# EAGLE design SCHEMATIC V2 (EAGLE 8.4.0)
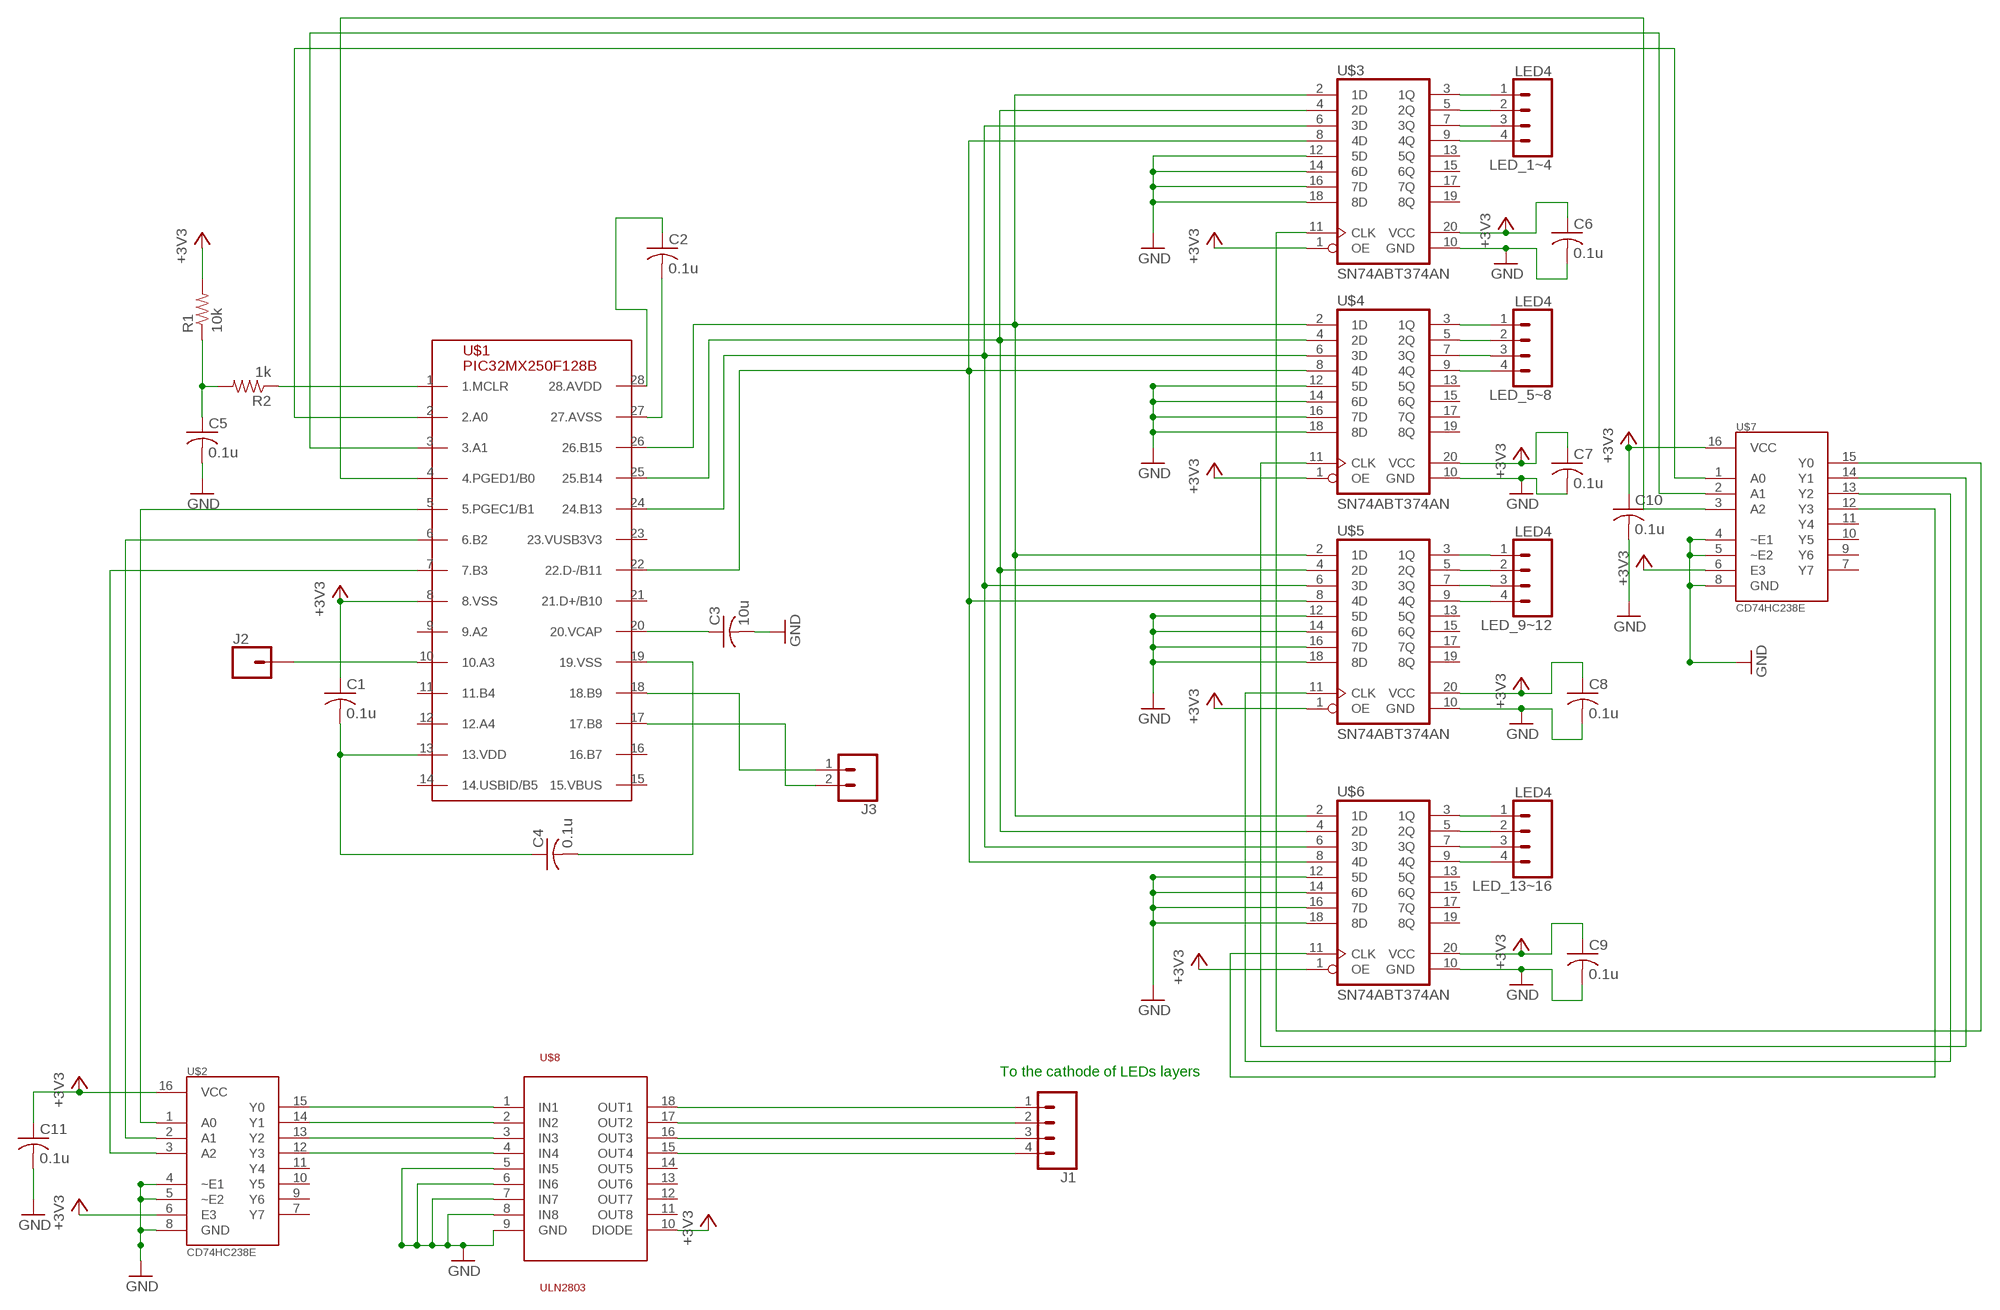
[diagram p0: schematic, sheet 1]

## Parts
C1  0.1u  C-US025-025X050  [C025-025X050]
C2  0.1u  C-US025-025X050  [C025-025X050]
C3  10u  C-US025-025X050  [C025-025X050]
C4  0.1u  C-US025-025X050  [C025-025X050]
C5  0.1u  C-US025-025X050  [C025-025X050]
C6  0.1u  C-US025-025X050  [C025-025X050]
C7  0.1u  C-US025-025X050  [C025-025X050]
C8  0.1u  C-US025-025X050  [C025-025X050]
C9  0.1u  C-US025-025X050  [C025-025X050]
C10  0.1u  C-US025-025X050  [C025-025X050]
C11  0.1u  C-US025-025X050  [C025-025X050]
J1  CONN_04  [1X04]
J2  CONN_01  [1X01]
J3  CONN_02  [1X02]
LED_1~4  LED4  [1X04]
LED_5~8  LED4  [1X04]
LED_9~12  LED4  [1X04]
LED_13~16  LED4  [1X04]
R1  10k  R-US_0204/7  [0204/7]
R2  1k  R-US_0204/7  [0204/7]
U$1  PIC32MX250F128B  [DIL28-3]
U$2  CD74HC238E  [DIL16]
U$3  SN74ABT374AN  [DIL20]
U$4  SN74ABT374AN  [DIL20]
U$5  SN74ABT374AN  [DIL20]
U$6  SN74ABT374AN  [DIL20]
U$7  CD74HC238E  [DIL16]
U$8  ULN2803  [SO18L]

## Nets
+3V3: C1.1 C6.1 C7.1 C8.1 C9.1 C10.1 C11.1 R1.2 U$1.8(8.VSS) U$2.6(E3) U$2.16(VCC) U$3.1(OE) U$3.20(VCC) U$4.1(OE) U$4.20(VCC) U$5.1(OE) U$5.20(VCC) U$6.1(OE) U$6.20(VCC) U$7.6(E3) U$7.16(VCC) U$8.10(DIODE)
GND: C3.2 C5.2 C6.2 C7.2 C8.2 C9.2 C10.2 C11.2 U$2.4(~E1) U$2.5(~E2) U$2.8(GND) U$3.10(GND) U$3.12(5D) U$3.14(6D) U$3.16(7D) U$3.18(8D) U$4.10(GND) U$4.12(5D) U$4.14(6D) U$4.16(7D) U$4.18(8D) U$5.10(GND) U$5.12(5D) U$5.14(6D) U$5.16(7D) U$5.18(8D) U$6.10(GND) U$6.12(5D) U$6.14(6D) U$6.16(7D) U$6.18(8D) U$7.4(~E1) U$7.5(~E2) U$7.8(GND) U$8.5(IN5) U$8.6(IN6) U$8.7(IN7) U$8.8(IN8) U$8.9(GND)
LED1: LED_1~4.1 U$3.3(1Q)
N$1: U$2.15(Y0) U$8.1(IN1)
N$2: U$2.14(Y1) U$8.2(IN2)
N$3: U$2.13(Y2) U$8.3(IN3)
N$4: U$2.12(Y3) U$8.4(IN4)
N$5: C1.2 C4.1 U$1.13(13.VDD)
N$6: J2.1 U$1.10(10.A3)
N$9: J1.1 U$8.18(OUT1)
N$10: J1.2 U$8.17(OUT2)
N$11: J1.3 U$8.16(OUT3)
N$12: J1.4 U$8.15(OUT4)
N$16: C3.1 U$1.20(20.VCAP)
N$17: U$1.5(5.PGEC1/B1) U$2.1(A0)
N$18: U$1.6(6.B2) U$2.2(A1)
N$19: U$1.7(7.B3) U$2.3(A2)
N$20: LED_9~12.1 U$5.3(1Q)
N$21: C4.2 U$1.19(19.VSS)
N$22: U$1.26(26.B15) U$3.2(1D) U$4.2(1D) U$5.2(1D) U$6.2(1D)
N$23: U$1.25(25.B14) U$3.4(2D) U$4.4(2D) U$5.4(2D) U$6.4(2D)
N$24: U$1.22(22.D-/B11) U$3.8(4D) U$4.8(4D) U$5.8(4D) U$6.8(4D)
N$25: U$1.24(24.B13) U$3.6(3D) U$4.6(3D) U$5.6(3D) U$6.6(3D)
N$26: C2.1 U$1.28(28.AVDD)
N$27: C2.2 U$1.27(27.AVSS)
N$28: C5.1 R1.1 R2.2
N$29: R2.1 U$1.1(1.MCLR)
N$31: U$3.11(CLK) U$7.15(Y0)
N$32: U$4.11(CLK) U$7.14(Y1)
N$33: U$1.3(3.A1) U$7.2(A1)
N$34: U$1.4(4.PGED1/B0) U$7.3(A2)
N$35: U$5.11(CLK) U$7.13(Y2)
N$36: U$6.11(CLK) U$7.12(Y3)
N$37: J3.1 U$1.18(18.B9)
N$38: LED_9~12.2 U$5.5(2Q)
N$39: U$1.2(2.A0) U$7.1(A0)
N$40: LED_1~4.2 U$3.5(2Q)
N$41: LED_1~4.3 U$3.7(3Q)
N$42: LED_1~4.4 U$3.9(4Q)
N$43: LED_9~12.3 U$5.7(3Q)
N$44: LED_9~12.4 U$5.9(4Q)
N$45: J3.2 U$1.17(17.B8)
N$47: LED_5~8.1 U$4.3(1Q)
N$48: LED_5~8.2 U$4.5(2Q)
N$49: LED_5~8.3 U$4.7(3Q)
N$50: LED_5~8.4 U$4.9(4Q)
N$63: LED_13~16.1 U$6.3(1Q)
N$64: LED_13~16.2 U$6.5(2Q)
N$65: LED_13~16.3 U$6.7(3Q)
N$66: LED_13~16.4 U$6.9(4Q)
Unconnected: U$1.9(9.A2) U$1.11(11.B4) U$1.12(12.A4) U$1.14(14.USBID/B5) U$1.15(15.VBUS) U$1.16(16.B7) U$1.21(21.D+/B10) U$1.23(23.VUSB3V3) U$2.7(Y7) U$2.9(Y6) U$2.10(Y5) U$2.11(Y4) U$3.13(5Q) U$3.15(6Q) U$3.17(7Q) U$3.19(8Q) U$4.13(5Q) U$4.15(6Q) U$4.17(7Q) U$4.19(8Q) U$5.13(5Q) U$5.15(6Q) U$5.17(7Q) U$5.19(8Q) U$6.13(5Q) U$6.15(6Q) U$6.17(7Q) U$6.19(8Q) U$7.7(Y7) U$7.9(Y6) U$7.10(Y5) U$7.11(Y4) U$8.11(OUT8) U$8.12(OUT7) U$8.13(OUT6) U$8.14(OUT5)

## Notes on the sheet
- To the cathode of LEDs layers

## Library data of the parts
C1-C11 = resistor:C-US: CAPACITOR, American symbol
J1 = SparkFun-Connectors:CONN_04: Multi connection point. Often used as Generic Header-pin footprint for 0.1 inch spaced/style header connections On any of the 0.1 inch spaced packages, you can populate with these: Break Away Headers - Straight <https://www.sparkfun.com/products/116> (PRT-00116) Break Away Male Headers - Right Angle <https://www.sparkfun.com/products/553> (PRT-00553) Female Headers <https://www.sparkfun.com/products/115> (PRT-00115) Break Away Headers - Machine Pin <https://www.sparkfun.com/products/117> (PRT-00117) Break Away Female Headers - Swiss Machine Pin <https://www.sparkfun.com/products/743> (PRT-00743) For SCREWTERMINALS and SPRING TERMINALS visit here: Screw Terimnals on SparkFun.com <https://www.sparkfun.com/search/results?term=Screw+Terminals> (5mm/3.5mm/2.54mm spacing) This device is also useful as a general connection point to wire up your design to another part of your project. Our various solder wires solder well into these plated through hole pads. Hook-Up Wire - Assortment (Stranded, 22 AWG) <https://www.sparkfun.com/products/11375> (PRT-11375) Hook-Up Wire - Assortment (Solid Core, 22 AWG) <https://www.sparkfun.com/products/11367> (PRT-11367) View the entire wire category on our website here <https://www.sparkfun.com/categories/141> Special notes: Molex polarized connector foot print use with SKU : PRT-08231 with associated crimp pins and housings. 1MM SMD Version SKU: PRT-10208; PROD_ID: CONN-09696
J2 = SparkFun-Connectors:CONN_01: Single connection point. Often used as Generic Header-pin footprint for 0.1 inch spaced/style header connections On any of the 0.1 inch spaced packages, you can populate with these: Break Away Headers - Straight <https://www.sparkfun.com/products/116> (PRT-00116) Break Away Male Headers - Right Angle <https://www.sparkfun.com/products/553> (PRT-00553) Female Headers <https://www.sparkfun.com/products/115> (PRT-00115) Break Away Headers - Machine Pin <https://www.sparkfun.com/products/117> (PRT-00117) Break Away Female Headers - Swiss Machine Pin <https://www.sparkfun.com/products/743> (PRT-00743) This device is also useful as a general connection point to wire up your design to another part of your project. Our various solder wires solder well into these plated through hole pads. Hook-Up Wire - Assortment (Stranded, 22 AWG) <https://www.sparkfun.com/products/11375> (PRT-11375) Hook-Up Wire - Assortment (Solid Core, 22 AWG) <https://www.sparkfun.com/products/11367> (PRT-11367) View the entire wire category on our website here <https://www.sparkfun.com/categories/141> Special notes: SMTSO-256-ET is a "flush mount" nut for a 4-40 screw. We mostly use this on specialty testbeds; it is a nice way to connect hardware to your PCB at an adjustable hieght. Also note, the SNAP packages are for using a snappable style connector. We sell a baggie of snaps and they are also used on two LilyPad designs: Snap Assortment - 30 pack (male and female) <https://www.sparkfun.com/products/11347> (DEV-11347) LilyPad Arduino SimpleSnap <https://www.sparkfun.com/products/10941> (DEV-10941) LilyPad SimpleSnap Protoboard <https://www.sparkfun.com/products/10940> (DEV-10940)
J3 = SparkFun-Connectors:CONN_02: Multi connection point. Often used as Generic Header-pin footprint for 0.1 inch spaced/style header connections On any of the 0.1 inch spaced packages, you can populate with these: Break Away Headers - Straight <https://www.sparkfun.com/products/116> (PRT-00116) Break Away Male Headers - Right Angle <https://www.sparkfun.com/products/553> (PRT-00553) Female Headers <https://www.sparkfun.com/products/115> (PRT-00115) Break Away Headers - Machine Pin <https://www.sparkfun.com/products/117> (PRT-00117) Break Away Female Headers - Swiss Machine Pin <https://www.sparkfun.com/products/743> (PRT-00743) For SCREWTERMINALS and SPRING TERMINALS visit here: Screw Terimnals on SparkFun.com <https://www.sparkfun.com/search/results?term=Screw+Terminals> (5mm/3.5mm/2.54mm spacing) This device is also useful as a general connection point to wire up your design to another part of your project. Our various solder wires solder well into these plated through hole pads. Hook-Up Wire - Assortment (Stranded, 22 AWG) <https://www.sparkfun.com/products/11375> (PRT-11375) Hook-Up Wire - Assortment (Solid Core, 22 AWG) <https://www.sparkfun.com/products/11367> (PRT-11367) View the entire wire category on our website here <https://www.sparkfun.com/categories/141> Special notes: Molex polarized connector foot print use with: PRT-08233 with associated crimp pins and housings. 2.54_SCREWTERM for use with PRT-10571. 3.5mm Screw Terminal footprints for PRT-08084 5mm Screw Terminal footprints for use with PRT-08432
LED_1~4 LED_5~8 LED_9~12 LED_13~16 = ECE411:LED4
R1 R2 = resistor:R-US_: RESISTOR, American symbol
U$1 = ECE411:PIC32MX250F128B
U$2 U$7 = ECE411:CD74HC238E
U$3-U$6 = ECE411:SN74ABT374AN
U$8 = uln2803:ULN2803

## Net classes
0 default: width 0.305 mm, drill 0.508 mm, clearance 0.254 mm

## Board
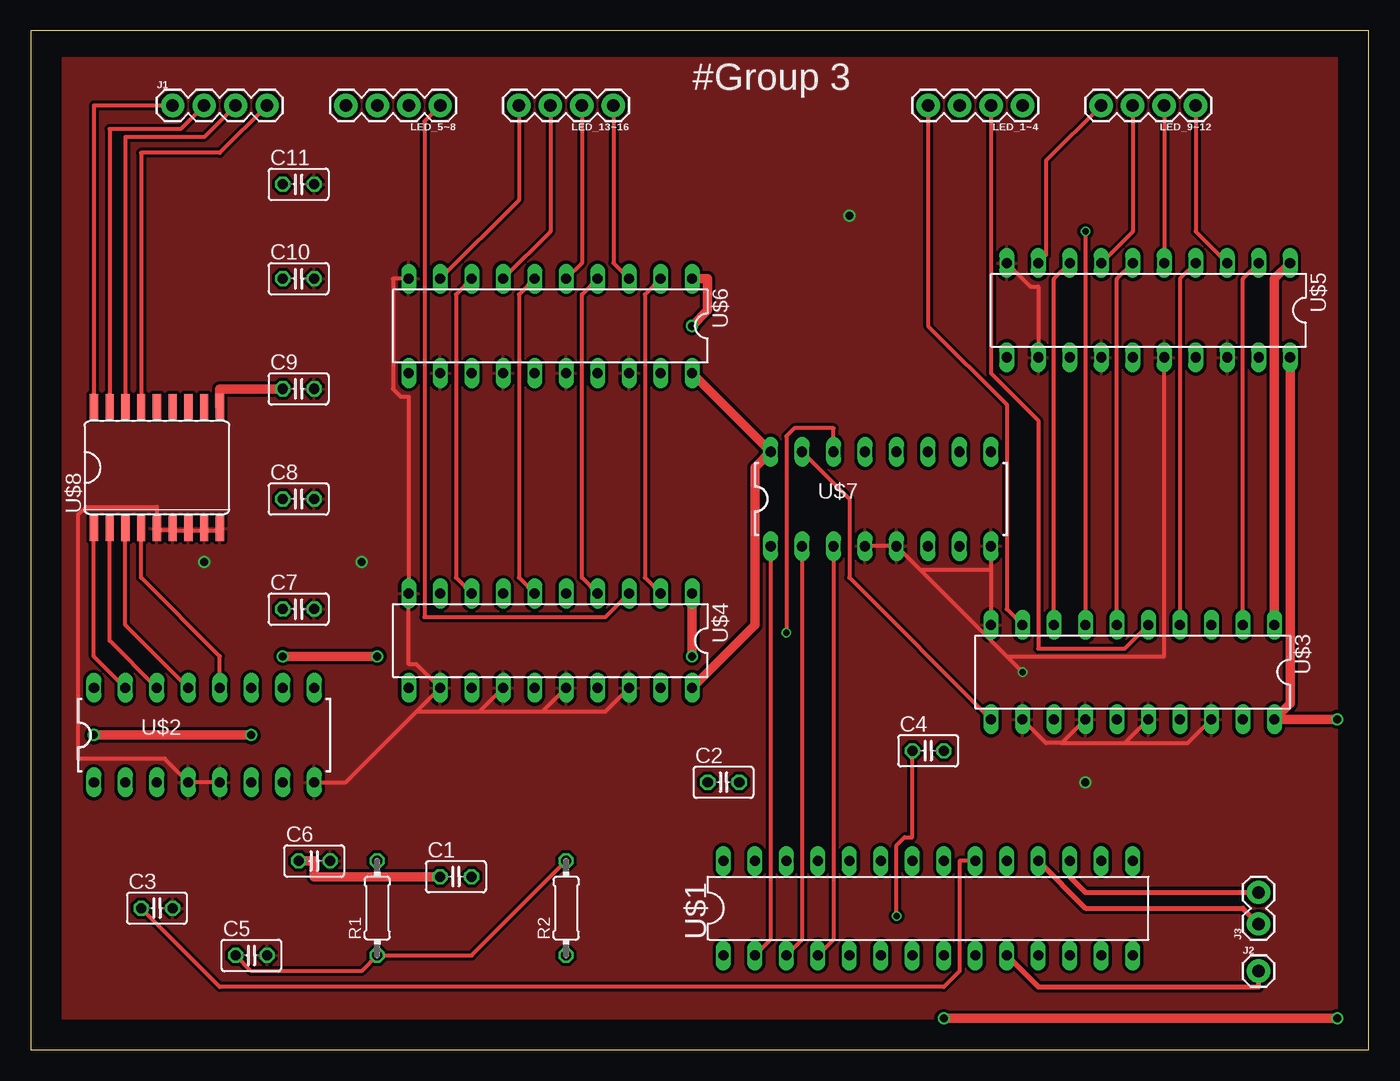
[diagram p1: board, top side]
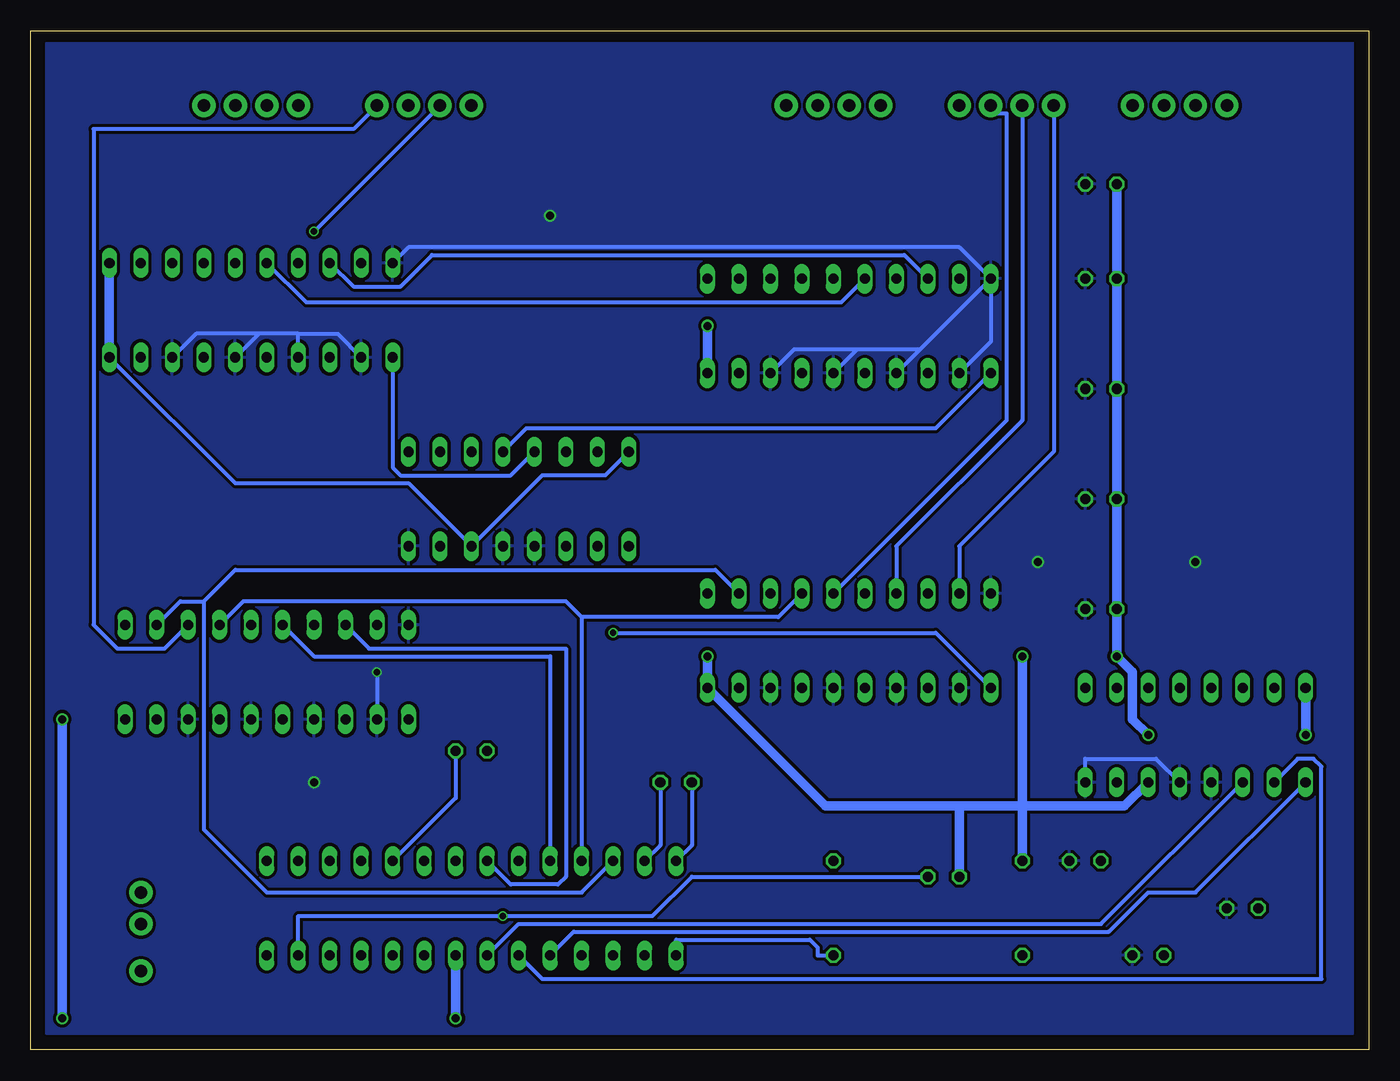
[diagram p2: board, bottom side, seen from below]

Size 107.93 x 82.22 mm. Coordinates in mm from the lower left corner, seen from the top.
Outline: 0,0 107.93,0 107.93,82.22 0,82.22 0,0
Copper layers (1*16): Top 0.035559375mm / dielectric 1.6mm / Bottom 0.035559375mm
Design rules "oshpark-2layer": minimum track width 6mil, minimum drill 10mil, track to track 6mil, track to pad 6mil, pad to pad 6mil, via to via 6mil, smd to smd 6mil, copper to edge 15mil, drill to drill 6mil, minimum pad ring 5mil, minimum via ring 5mil, stop-mask expansion 2.5mil, vias tented up to drill 0mil, thermal gap 10mil

### Footprints (pad centres in the part's own frame; a part is rotated, then mirrored left to right if it is on the bottom)
C025-025X050 = drill 0.813 octagon: 1 -1.27,0; 2 1.27,0
1X04 = drill 1.016 pad 1.88: 1 0,0; 2 2.54,0; 3 5.08,0; 4 7.62,0
1X01 = drill 1.016 pad 1.88: 1 0,0
1X02 = drill 1.016 pad 1.88: 1 0,0; 2 2.54,0
0204/7 = drill 0.813 octagon: 1 -3.81,0; 2 3.81,0
DIL28-3 = drill 0.813 long: 1 -16.51,-3.81; 2 -13.97,-3.81; 3 -11.43,-3.81; 4 -8.89,-3.81; 5 -6.35,-3.81; 6 -3.81,-3.81; 7 -1.27,-3.81; 8 1.27,-3.81; 9 3.81,-3.81; 10 6.35,-3.81; 11 8.89,-3.81; 12 11.43,-3.81; 13 13.97,-3.81; 14 16.51,-3.81; 15 16.51,3.81; 16 13.97,3.81; 17 11.43,3.81; 18 8.89,3.81; 19 6.35,3.81; 20 3.81,3.81; 21 1.27,3.81; 22 -1.27,3.81; 23 -3.81,3.81; 24 -6.35,3.81; 25 -8.89,3.81; 26 -11.43,3.81; 27 -13.97,3.81; 28 -16.51,3.81
DIL16 = drill 0.813 long: 1 -8.89,-3.81; 2 -6.35,-3.81; 3 -3.81,-3.81; 4 -1.27,-3.81; 5 1.27,-3.81; 6 3.81,-3.81; 7 6.35,-3.81; 8 8.89,-3.81; 9 8.89,3.81; 10 6.35,3.81; 11 3.81,3.81; 12 1.27,3.81; 13 -1.27,3.81; 14 -3.81,3.81; 15 -6.35,3.81; 16 -8.89,3.81
DIL20 = drill 0.813 long: 1 -11.43,-3.81; 2 -8.89,-3.81; 3 -6.35,-3.81; 4 -3.81,-3.81; 5 -1.27,-3.81; 6 1.27,-3.81; 7 3.81,-3.81; 8 6.35,-3.81; 9 8.89,-3.81; 10 11.43,-3.81; 11 11.43,3.81; 12 8.89,3.81; 13 6.35,3.81; 14 3.81,3.81; 15 1.27,3.81; 16 -1.27,3.81; 17 -3.81,3.81; 18 -6.35,3.81; 19 -8.89,3.81; 20 -11.43,3.81
SO18L = smd 0.66 x 2.032: 1 -5.08,-4.902; 2 -3.81,-4.902; 3 -2.54,-4.902; 4 -1.27,-4.902; 5 0,-4.902; 6 1.27,-4.902; 7 2.54,-4.902; 8 3.81,-4.902; 9 5.08,-4.902; 10 5.08,4.902; 11 3.81,4.902; 12 2.54,4.902; 13 1.27,4.902; 14 0,4.902; 15 -1.27,4.902; 16 -2.54,4.902; 17 -3.81,4.902; 18 -5.08,4.902

### Placement (x,y rotation side)
C1  34.29,13.97 0 top
C2  55.88,21.59 0 top
C3  10.16,11.43 0 top
C4  72.39,24.13 0 top
C5  17.78,7.62 0 top
C6  22.86,15.24 0 top
C7  21.59,35.56 0 top
C8  21.59,44.45 0 top
C9  21.59,53.34 0 top
C10  21.59,62.23 0 top
C11  21.59,69.85 0 top
J1  11.43,76.2 0 top
J2  99.06,6.35 0 top
J3  99.06,10.16 90 top
LED_1~4  80.01,76.2 180 top
LED_5~8  33.02,76.2 180 top
LED_9~12  93.98,76.2 180 top
LED_13~16  46.99,76.2 180 top
R1  27.94,11.43 90 top
R2  43.18,11.43 90 top
U$1  72.39,11.43 0 top
U$2  13.97,25.4 0 top
U$3  88.9,30.48 180 top
U$4  41.91,33.02 180 top
U$5  90.17,59.69 180 top
U$6  41.91,58.42 180 top
U$7  68.58,44.45 0 top
U$8  10.16,46.99 0 top

### Tracks (layer width: path | path; a pad name or v marks a point on that pad's centre or on a via)
+3V3  (via drill 0.65)
  Top 0.762: U$3.1 100.33,62.23 U$5.1 | U$4.20 58.42,34.29 58.42,46.99 U$7.16 U$6.20 | U$5.20 101.6,27.94 U$3.20 v105.41,26.67 | U$4.1 v53.34,31.75 | v105.41,2.54 v73.66,2.54 | v53.34,58.42 54.61,59.69 54.61,62.23 U$6.1 | C1.1 22.86,13.97 22.86,15.24 C6.1 | v27.94,31.75 v20.32,31.75 | v5.08,25.4 v17.78,25.4 | C9.1 15.24,53.34 U$8.10
  Bottom 0.305: U$7.16 61.59,46.35 66.67,46.35 U$7.6 77.47,45.72 91.44,45.72 U$5.20
  Bottom 0.762: U$2.6 19.68,19.68 27.94,19.68 | 33.02,19.68 43.81,19.68 U$4.20 v53.34,31.75 | 33.02,19.68 27.94,19.68 | 33.02,19.68 C1.1 | 27.94,19.68 R1.2 | U$5.1 U$5.20 | v73.66,2.54 U$1.8 | v105.41,26.67 v105.41,2.54 | v53.34,58.42 U$6.20 | 27.94,19.68 v27.94,31.75 | v17.78,25.4 19.05,26.67 19.05,30.48 v20.32,31.75 C7.1 C8.1 C9.1 C10.1 C11.1 | U$2.16 v5.08,25.4
GND  (via drill 0.51, 0.65)
  Top 0.305: U$7.4 U$7.5 71.75,38.73 | U$7.8 77.47,38.73 | 77.47,38.73 U$3.10 | 77.47,38.73 71.75,38.73 | U$2.5 U$2.4 10.79,23.5 3.81,23.5 3.81,43.18 4.45,43.81 10.16,43.81 U$8.5 10.16,41.91 11.43,41.91 | U$3.12 81.92,24.77 83.19,24.77 | U$3.14 83.19,24.77 | 88.27,24.77 U$3.16 | 83.19,24.77 88.27,24.77 | U$3.18 93.34,24.77 88.27,24.77 | 31.11,27.3 25.4,21.59 U$2.8 | 31.11,27.3 U$4.12 31.11,31.11 30.48,31.11 U$4.10 30.48,52.7 29.84,52.7 29.21,53.34 29.21,62.23 U$6.10 | 36.2,27.3 U$4.14 | 31.11,27.3 36.2,27.3 | 41.27,27.3 U$4.16 | 36.2,27.3 41.27,27.3 | U$4.18 46.35,27.3 41.27,27.3 | 71.75,38.73 78.74,31.75 | 78.74,31.75 v80.01,30.48 | U$5.12 81.28,61.59 80.64,61.59 U$5.10 | U$5.16 91.44,31.75 78.74,31.75 | 11.43,41.91 12.7,41.91 | 11.43,41.91 U$8.6 | 12.7,41.91 13.97,41.91 | 12.7,41.91 U$8.7 | 13.97,41.91 15.24,41.91 U$8.9 | 13.97,41.91 U$8.8
  Bottom 0.305: U$5.10 77.47,64.77 33.02,64.77 U$6.10 | U$5.12 83.19,57.78 86.36,57.78 | U$5.14 86.36,57.78 | 89.53,57.78 U$5.16 | 86.36,57.78 89.53,57.78 | U$5.18 94.61,57.78 89.53,57.78 | U$6.12 30.48,57.15 U$6.10 | U$6.10 36.2,56.52 | 36.2,56.52 U$6.14 | 41.27,56.52 U$6.16 | 36.2,56.52 41.27,56.52 | U$6.18 46.35,56.52 41.27,56.52 | v80.01,30.48 U$3.12 | U$2.5 17.14,23.5 22.86,23.5 U$2.8
  other vias: 66.04,67.31 85.09,21.59 26.67,39.37 13.97,39.37
  pour Bottom: 1.27,81.28 1.27,1.27 106.68,1.27 106.68,81.28
  pour Top: 2.54,80.01 2.54,2.54 105.41,2.54 105.41,80.01
LED1
  Bottom 0.305: U$3.3 97.16,32.38 100.97,32.38 102.87,34.29 102.87,74.3 81.92,74.3 LED_1~4.1
N$1
  Top 0.305: U$8.1 5.08,31.75 U$2.15
N$2
  Top 0.305: U$8.2 6.35,33.02 U$2.14
N$3
  Top 0.305: U$8.3 7.62,34.29 U$2.13
N$4
  Top 0.305: U$8.4 8.89,38.1 15.24,31.75 U$2.12
N$5  (via drill 0.51)
  Top 0.305: C4.1 71.12,17.14 70.48,17.14 69.85,16.51 v69.85,10.79
  Bottom 0.305: C1.2 54.61,13.97 57.78,10.79 v69.85,10.79 86.36,10.79 U$1.13
N$6
  Top 0.406: U$1.10 81.28,5.08 99.06,5.08 J2.1
N$9
  Top 0.305: U$8.18 5.08,76.2 J1.1
N$10
  Top 0.305: U$8.17 6.35,74.3 12.06,74.3 J1.2
N$11
  Top 0.305: U$8.16 7.62,73.66 13.97,73.66 J1.3
N$12
  Top 0.305: U$8.15 8.89,72.39 15.24,72.39 J1.4
N$16
  Top 0.305: C3.1 15.24,5.08 73.66,5.08 74.93,6.35 74.93,15.24 U$1.20
N$17
  Bottom 0.305: U$2.1 13.97,12.7 17.78,12.7 20.95,9.53 64.14,9.53 U$1.5
N$18
  Bottom 0.305: U$2.2 5.71,23.5 4.45,23.5 3.81,22.86 3.81,5.71 66.67,5.71 U$1.6
N$19
  Bottom 0.305: U$2.3 21.59,10.16 68.58,10.16 U$1.7
N$20
  Top 0.305: U$5.3 93.98,66.04 LED_9~12.1
N$21
  Bottom 0.305: U$1.19 73.66,20.32 C4.2
N$22
  Top 0.305: U$4.2 49.53,38.1 49.53,60.96 U$6.2 | U$5.2 97.79,62.23 U$3.2
  Bottom 0.305: U$1.26 63.5,12.7 88.9,12.7 93.98,17.78 93.98,36.2 | 93.98,36.2 95.89,36.2 U$3.2 | U$4.2 52.7,38.73 91.44,38.73 93.98,36.2
N$23
  Top 0.305: U$3.4 92.71,62.23 U$5.4 | U$6.4 44.45,60.96 44.45,38.1 U$4.4
  Bottom 0.305: 63.5,34.92 U$1.25 | 63.5,34.92 47.62,34.92 U$4.4 | U$3.4 90.81,36.2 64.77,36.2 63.5,34.92
N$24
  Top 0.305: U$4.8 34.29,38.1 34.29,60.96 U$6.8 | U$5.8 82.55,62.23 U$3.8
  Bottom 0.305: U$1.22 69.22,13.34 65.41,13.34 64.77,13.97 64.77,32.38 80.64,32.38 U$3.8 | U$6.8 37.47,64.14 75.56,64.14 78.11,61.59 81.92,61.59 U$5.8
N$25
  Top 0.305: U$4.6 39.37,38.1 39.37,60.96 U$6.6 | U$5.6 87.63,62.23 U$3.6
  Bottom 0.305: U$1.24 66.04,31.75 85.09,31.75 U$3.6 | U$6.6 42.55,60.33 85.72,60.33 U$5.6
N$26
  Bottom 0.305: U$1.28 54.61,16.51 C2.1
N$27
  Bottom 0.305: U$1.27 57.15,16.51 C2.2
N$28
  Top 0.305: C5.1 17.78,6.35 26.67,6.35 R1.1 35.56,7.62 R2.2
N$29
  Bottom 0.305: R2.1 44.45,7.62 44.45,8.26 45.09,8.89 55.88,8.89 U$1.1
N$31
  Top 0.305: U$3.11 66.04,38.1 66.04,44.45 U$7.15
N$32  (via drill 0.51)
  Top 0.305: v60.96,33.66 60.96,49.53 61.59,50.16 64.77,50.16 U$7.14
  Bottom 0.305: U$4.11 34.92,33.66 v60.96,33.66
N$33
  Top 0.305: U$1.3 62.23,8.89 U$7.2
N$34
  Top 0.305: U$1.4 64.77,8.89 U$7.3
N$35
  Bottom 0.305: U$7.13 69.22,46.35 78.11,46.35 78.74,46.99 U$5.11
N$36
  Bottom 0.305: U$6.11 34.92,50.16 67.94,50.16 U$7.12
N$37
  Top 0.406: J3.1 97.79,11.43 85.09,11.43 U$1.18
N$38
  Top 0.305: LED_9~12.2 U$5.5
N$39
  Top 0.305: U$1.2 59.69,8.89 U$7.1
N$40
  Top 0.305: U$3.5 88.27,32.38 81.28,32.38 81.28,50.8 77.47,54.61 LED_1~4.2
N$41  (via drill 0.51)
  Top 0.305: v85.09,66.04 U$3.7
  Bottom 0.305: LED_1~4.3 v85.09,66.04
N$42
  Top 0.305: U$3.9 78.74,35.56 78.74,52.07 72.39,58.42 LED_1~4.4
N$43
  Top 0.305: U$5.7 88.9,66.04 LED_9~12.3
N$44
  Top 0.305: U$5.9 81.92,64.14 81.92,71.75 LED_9~12.4
N$45
  Top 0.406: J3.2 85.09,12.7 83.82,13.97 U$1.17
N$47
  Top 0.305: U$4.3 46.35,34.92 31.75,34.92 31.75,74.93 LED_5~8.1
N$48
  Bottom 0.305: U$4.5 29.21,50.8 29.21,75.56 29.84,75.56 LED_5~8.2
N$49
  Bottom 0.305: U$4.7 38.1,40.64 27.94,50.8 LED_5~8.3
N$50
  Bottom 0.305: U$4.9 33.02,40.64 25.4,48.26 LED_5~8.4
N$63
  Top 0.305: U$6.3 46.99,63.5 LED_13~16.1
N$64
  Top 0.305: U$6.5 44.45,63.5 LED_13~16.2
N$65
  Top 0.305: U$6.7 41.91,66.04 LED_13~16.3
N$66
  Top 0.305: U$6.9 39.37,68.58 LED_13~16.4

### Text on the board
tSilk: #Group 3